# Altium project FM25V20A_base.PrjPcb
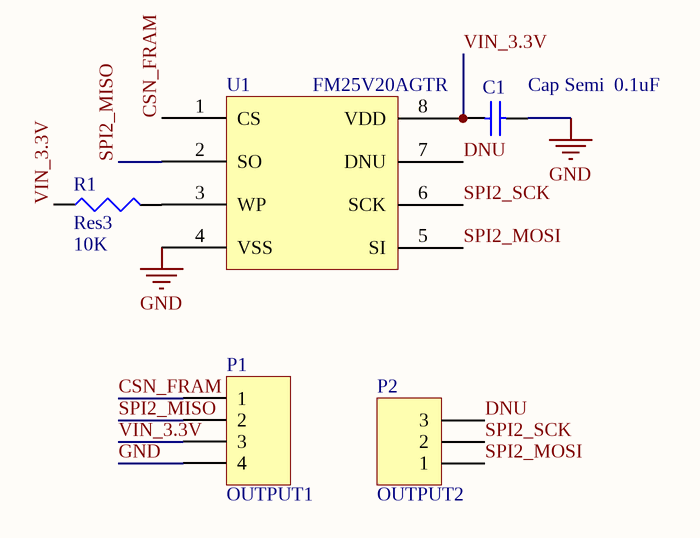
[diagram p0: FM25V20A_base.SchDoc]
1 sheet, 5 parts. Net scope: global (net labels, ports and power ports of the same name join across sheets).
Board file: FM25V20A_base.PcbDoc

## Sheet FM25V20A_base.SchDoc
size A4; SheetNumber: 1; SheetTotal: 1; SPICEModelCacheFNGOERVY: <root> / <DocumentId>FNGOERVY</DocumentId> / <CacheFrame Number="0"> / <Model Name="cap" Kind="MDL"> / <Text>*Default semiconductor capacitor / .MODEL CAP C()</Text> / </Model> / </CacheFrame> / </root>

### Parts
C1  Cap Semi  value 0.1uF  [1608[0603]]
P1  OUTPUT1  [HDR1X4]
P2  OUTPUT2  [HDR1X3]
R1  Res3  value 10K  [J1-0603]
U1  FM25V20AGTR  [SOIC-8N]

### Nets
GND: C1.2 P1.4 U1.4(VSS)
CSN_FRAM: P1.1 U1.1(CS)
DNU: P2.3 U1.7(DNU)
SPI2_MISO: P1.2 U1.2(SO)
SPI2_MOSI: P2.1 U1.5(SI)
SPI2_SCK: P2.2 U1.6(SCK)
VIN_3.3V: C1.1 P1.3 R1.1 U1.8(VDD)
NetR1_2: R1.2 U1.3(WP)

### Library data of the parts
C1 = Cap Semi: Capacitor (Semiconductor SIM Model); Published: 8-Jun-2000; LatestRevisionDate: 29-May-2009; LatestRevisionNote: IPC-7351 Footprint Added.; PackageReference: C1206; Publisher: Altium Limited; PackageDescription: Chip Capacitor
P1 = Header 4: Header, 4-Pin; LatestRevisionDate: 17-Jul-2002; LatestRevisionNote: Re-released for DXP Platform.; Publisher: Altium Limited
P2 = Header 3: Header, 3-Pin; LatestRevisionDate: 17-Jul-2002; LatestRevisionNote: Re-released for DXP Platform.; Publisher: Altium Limited
R1 = Res3: Resistor; Published: 8-Jun-2000; LatestRevisionDate: 29-May-2009; LatestRevisionNote: IPC-7351 Footprint Added.; PackageReference: J1-0603; Publisher: Altium Limited; PackageDescription: Chip Resistor